# EAGLE design Clock Schematic v.1 (EAGLE 9.3.0)
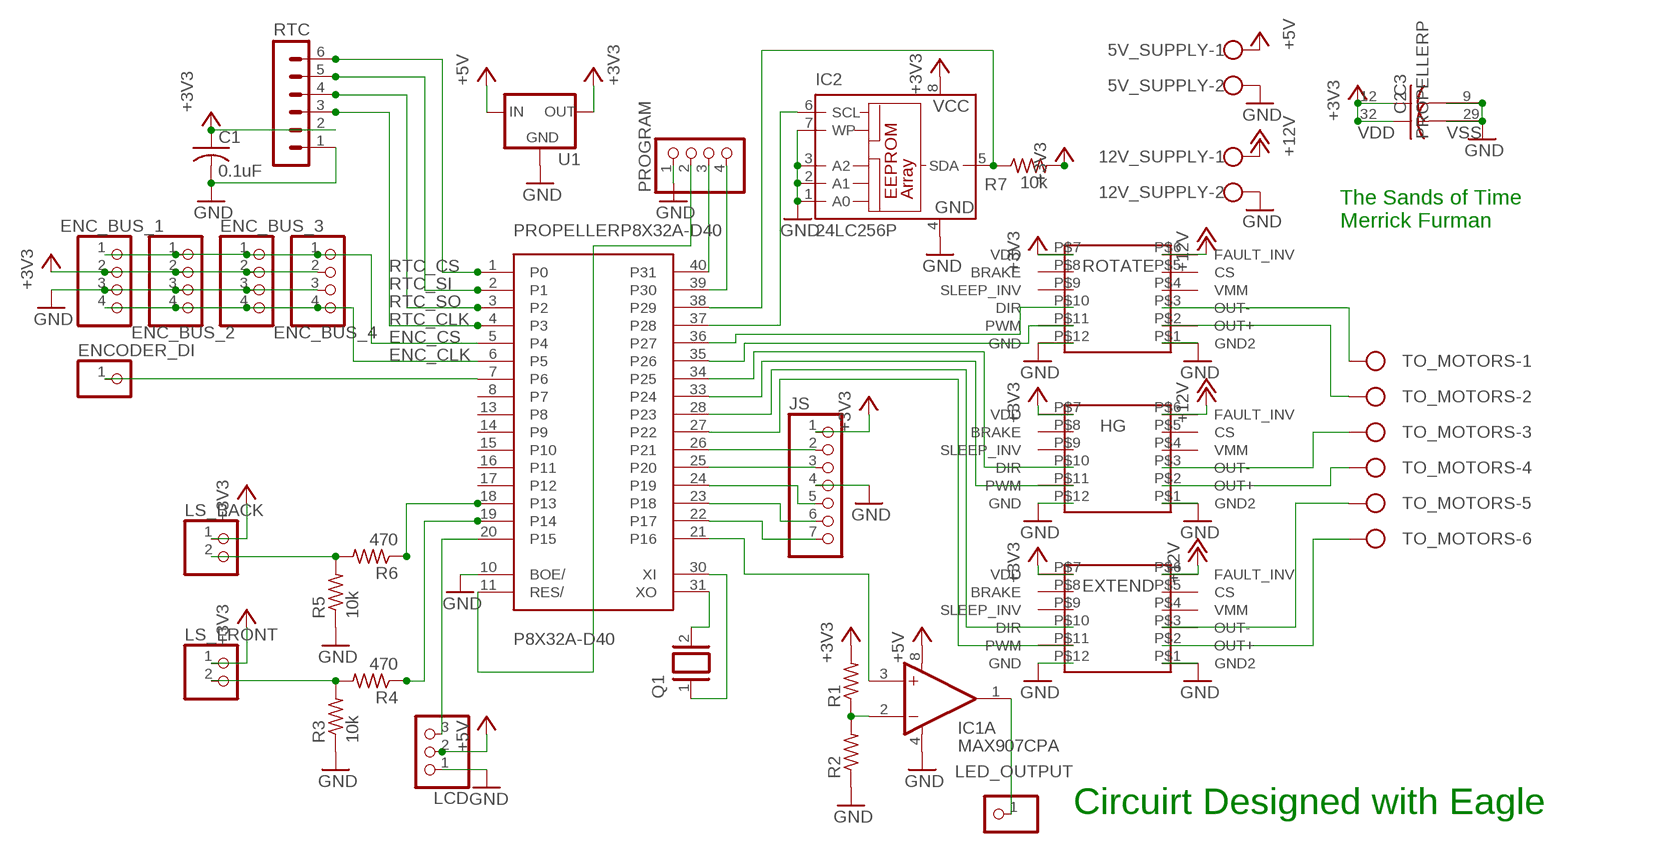
[diagram p0: schematic, sheet 1]

## Parts
5V_SUPPLY  W237-102  [W237-102]
12V_SUPPLY  W237-102  [W237-102]
C1  0.1uF  C-US050-025X075  [C050-025X075]
C2  C-US050-025X075  [C050-025X075]
C3  C-US050-025X075  [C050-025X075]
ENC_BUS_1  PINHD-1X4  [1X04]
ENC_BUS_2  PINHD-1X4  [1X04]
ENC_BUS_3  PINHD-1X4  [1X04]
ENC_BUS_4  PINHD-1X4  [1X04]
ENCODER_DI  PINHD-1X1  [1X01]
EXTEND  DRV  [DRV]
HG  DRV  [DRV]
IC1  MAX907CPA  [DIL08]
IC2  24LC256P  [DIL8]
JS  PINHD-1X7  [1X07]
LCD  PINHD-1X3  [1X03]
LED_OUTPUT  PINHD-1X1  [1X01]
LS_BACK  PINHD-1X2  [1X02]
LS_FRONT  PINHD-1X2  [1X02]
PROGRAM  PINHD-1X4  [1X04]
PROPELLER  P8X32A-D40  [P8X32A-D40]
Q1  XTAL/S  [QS]
R1  R-US_0207/10  [0207/10]
R2  R-US_0207/10  [0207/10]
R3  10k  R-US_0207/10  [0207/10]
R4  470  R-US_0207/10  [0207/10]
R5  10k  R-US_0207/10  [0207/10]
R6  470  R-US_0207/10  [0207/10]
R7  10k  R-US_0207/10  [0207/10]
ROTATE  DRV  [DRV]
RTC  MA06-1  [MA06-1]
TO_MOTORS  W237-6  [W237-6]
U1  V_REG_78XXSIDE  [78XXL]

## Nets
+3V3: C1.1 C2.1 C3.1 ENC_BUS_1.2 ENC_BUS_2.2 ENC_BUS_3.2 ENC_BUS_4.2 EXTEND.P$7(VDD) HG.P$7(VDD) IC2.8(VCC) JS.1 LS_BACK.1 LS_FRONT.1 PROPELLER.12(P:VDD) PROPELLER.32(P:VDD) R1.2 R7.2 ROTATE.P$7(VDD) RTC.2 U1.OUT
+5V: 5V_SUPPLY.1 IC1.8(A:V+) LCD.2 U1.IN
+12V: 12V_SUPPLY.1 EXTEND.P$6(FAULT_INV) HG.P$6(FAULT_INV) ROTATE.P$6(FAULT_INV)
ENC_CLK: ENC_BUS_1.4 ENC_BUS_2.4 ENC_BUS_3.4 ENC_BUS_4.4 PROPELLER.6(P8X32A-D40:P5)
ENC_CS: ENC_BUS_1.1 ENC_BUS_2.1 ENC_BUS_3.1 ENC_BUS_4.1 PROPELLER.5(P8X32A-D40:P4)
GND: 5V_SUPPLY.2 12V_SUPPLY.2 C1.2 C2.2 C3.2 ENC_BUS_1.3 ENC_BUS_2.3 ENC_BUS_3.3 ENC_BUS_4.3 EXTEND.P$1(GND2) EXTEND.P$12(GND) HG.P$1(GND2) HG.P$12(GND) IC1.4(A:V-) IC2.1(A0) IC2.2(A1) IC2.3(A2) IC2.4(GND) IC2.7(WP) JS.4 LCD.1 PROGRAM.1 PROPELLER.9(P:VSS) PROPELLER.10(P8X32A-D40:BOE/) PROPELLER.29(P:VSS) R2.1 R3.1 R5.1 ROTATE.P$1(GND2) ROTATE.P$12(GND) RTC.1 U1.GND
N$1: ENCODER_DI.1 PROPELLER.7(P8X32A-D40:P6)
N$2: JS.5 PROPELLER.24(P8X32A-D40:P19)
N$3: JS.6 PROPELLER.23(P8X32A-D40:P18)
N$4: JS.7 PROPELLER.22(P8X32A-D40:P17)
N$5: JS.3 PROPELLER.25(P8X32A-D40:P20)
N$6: JS.2 PROPELLER.26(P8X32A-D40:P21)
N$7: LCD.3 PROPELLER.20(P8X32A-D40:P15)
N$8: IC1.3(A:+IN) PROPELLER.21(P8X32A-D40:P16)
N$9: IC1.1(A:OUT) LED_OUTPUT.1
N$10: PROPELLER.31(P8X32A-D40:XO) Q1.2
N$11: IC1.2(A:-IN) R1.1 R2.2
N$12: PROPELLER.30(P8X32A-D40:XI) Q1.1
N$13: PROPELLER.19(P8X32A-D40:P14) R4.1
N$14: LS_BACK.2 R5.2 R6.2
N$15: PROPELLER.18(P8X32A-D40:P13) R6.1
N$16: IC2.6(SCL) PROPELLER.37(P8X32A-D40:P28)
N$17: EXTEND.P$11(PWM) PROPELLER.27(P8X32A-D40:P22)
N$18: PROGRAM.4 PROPELLER.39(P8X32A-D40:P30)
N$19: PROGRAM.3 PROPELLER.40(P8X32A-D40:P31)
N$20: IC2.5(SDA) PROPELLER.38(P8X32A-D40:P29) R7.1
N$22: EXTEND.P$10(DIR) PROPELLER.28(P8X32A-D40:P23)
N$23: HG.P$11(PWM) PROPELLER.33(P8X32A-D40:P24)
N$24: HG.P$10(DIR) PROPELLER.34(P8X32A-D40:P25)
N$25: PROPELLER.35(P8X32A-D40:P26) ROTATE.P$11(PWM)
N$26: PROGRAM.2 PROPELLER.11(P8X32A-D40:RES/)
N$27: LS_FRONT.2 R3.2 R4.2
N$28: PROPELLER.36(P8X32A-D40:P27) ROTATE.P$10(DIR)
N$29: ROTATE.P$3(OUT-) TO_MOTORS.1
N$30: ROTATE.P$2(OUT+) TO_MOTORS.2
N$31: HG.P$3(OUT-) TO_MOTORS.3
N$32: HG.P$2(OUT+) TO_MOTORS.4
N$33: EXTEND.P$3(OUT-) TO_MOTORS.5
N$34: EXTEND.P$2(OUT+) TO_MOTORS.6
RTC_CLK: PROPELLER.4(P8X32A-D40:P3) RTC.3
RTC_CS: PROPELLER.1(P8X32A-D40:P0) RTC.6
RTC_SI: PROPELLER.2(P8X32A-D40:P1) RTC.5
RTC_SO: PROPELLER.3(P8X32A-D40:P2) RTC.4
Unconnected: EXTEND.P$4(VMM) EXTEND.P$5(CS) EXTEND.P$8(BRAKE) EXTEND.P$9(SLEEP_INV) HG.P$4(VMM) HG.P$5(CS) HG.P$8(BRAKE) HG.P$9(SLEEP_INV) IC1.5(B:+IN) IC1.6(B:-IN) IC1.7(B:OUT) PROPELLER.8(P8X32A-D40:P7) PROPELLER.13(P8X32A-D40:P8) PROPELLER.14(P8X32A-D40:P9) PROPELLER.15(P8X32A-D40:P10) PROPELLER.16(P8X32A-D40:P11) PROPELLER.17(P8X32A-D40:P12) ROTATE.P$4(VMM) ROTATE.P$5(CS) ROTATE.P$8(BRAKE) ROTATE.P$9(SLEEP_INV)

## Notes on the sheet
- The Sands of Time
  Merrick Furman
- Circuirt Designed with Eagle

## Library data of the parts
5V_SUPPLY 12V_SUPPLY = con-wago-500:W237-102: WAGO SCREW CLAMP; MPN: 237-102; OC_FARNELL: unknown; OC_NEWARK: 70K9898
C1-C3 = rcl:C-US: CAPACITOR, American symbol; SPICEPREFIX: C
ENC_BUS_1-ENC_BUS_4 PROGRAM = pinhead:PINHD-1X4: PIN HEADER
ENCODER_DI LED_OUTPUT = pinhead:PINHD-1X1: PIN HEADER
EXTEND HG ROTATE = Pololu_DRV8801_Breakout:DRV
IC1 = maxim:MAX907CPA: COMPARATOR; MF: MAXIM; MPN: MAX907CPA; OC_FARNELL: unknown; OC_NEWARK: 79C3004
IC2 = microchip:24*: Serial EEPROM I2C; MF: MICROCHIP; MPN: 24LC256-E/P; OC_FARNELL: 9757970; OC_NEWARK: 92C7169
JS = pinhead:PINHD-1X7: PIN HEADER
LCD = pinhead:PINHD-1X3: PIN HEADER
LS_BACK LS_FRONT = pinhead:PINHD-1X2: PIN HEADER
PROPELLER = parallax_propeller:P8X32A-D40
Q1 = special:XTAL/S: CRYSTAL
R1-R7 = rcl:R-US_: RESISTOR, American symbol; SPICEPREFIX: R
RTC = con-lstb:MA06-1: PIN HEADER; OC_FARNELL: unknown; OC_NEWARK: unknown
TO_MOTORS = con-wago-500:W237-6: WAGO SCREW CLAMP; OC_FARNELL: unknown; OC_NEWARK: unknown
U1 = SparkFun-IC-Power:V_REG_78XX: Voltage Regulator Standard 78xx regulator. IGO (Input Ground Output). Spark Fun Electronics SKU : COM-00107

## Board
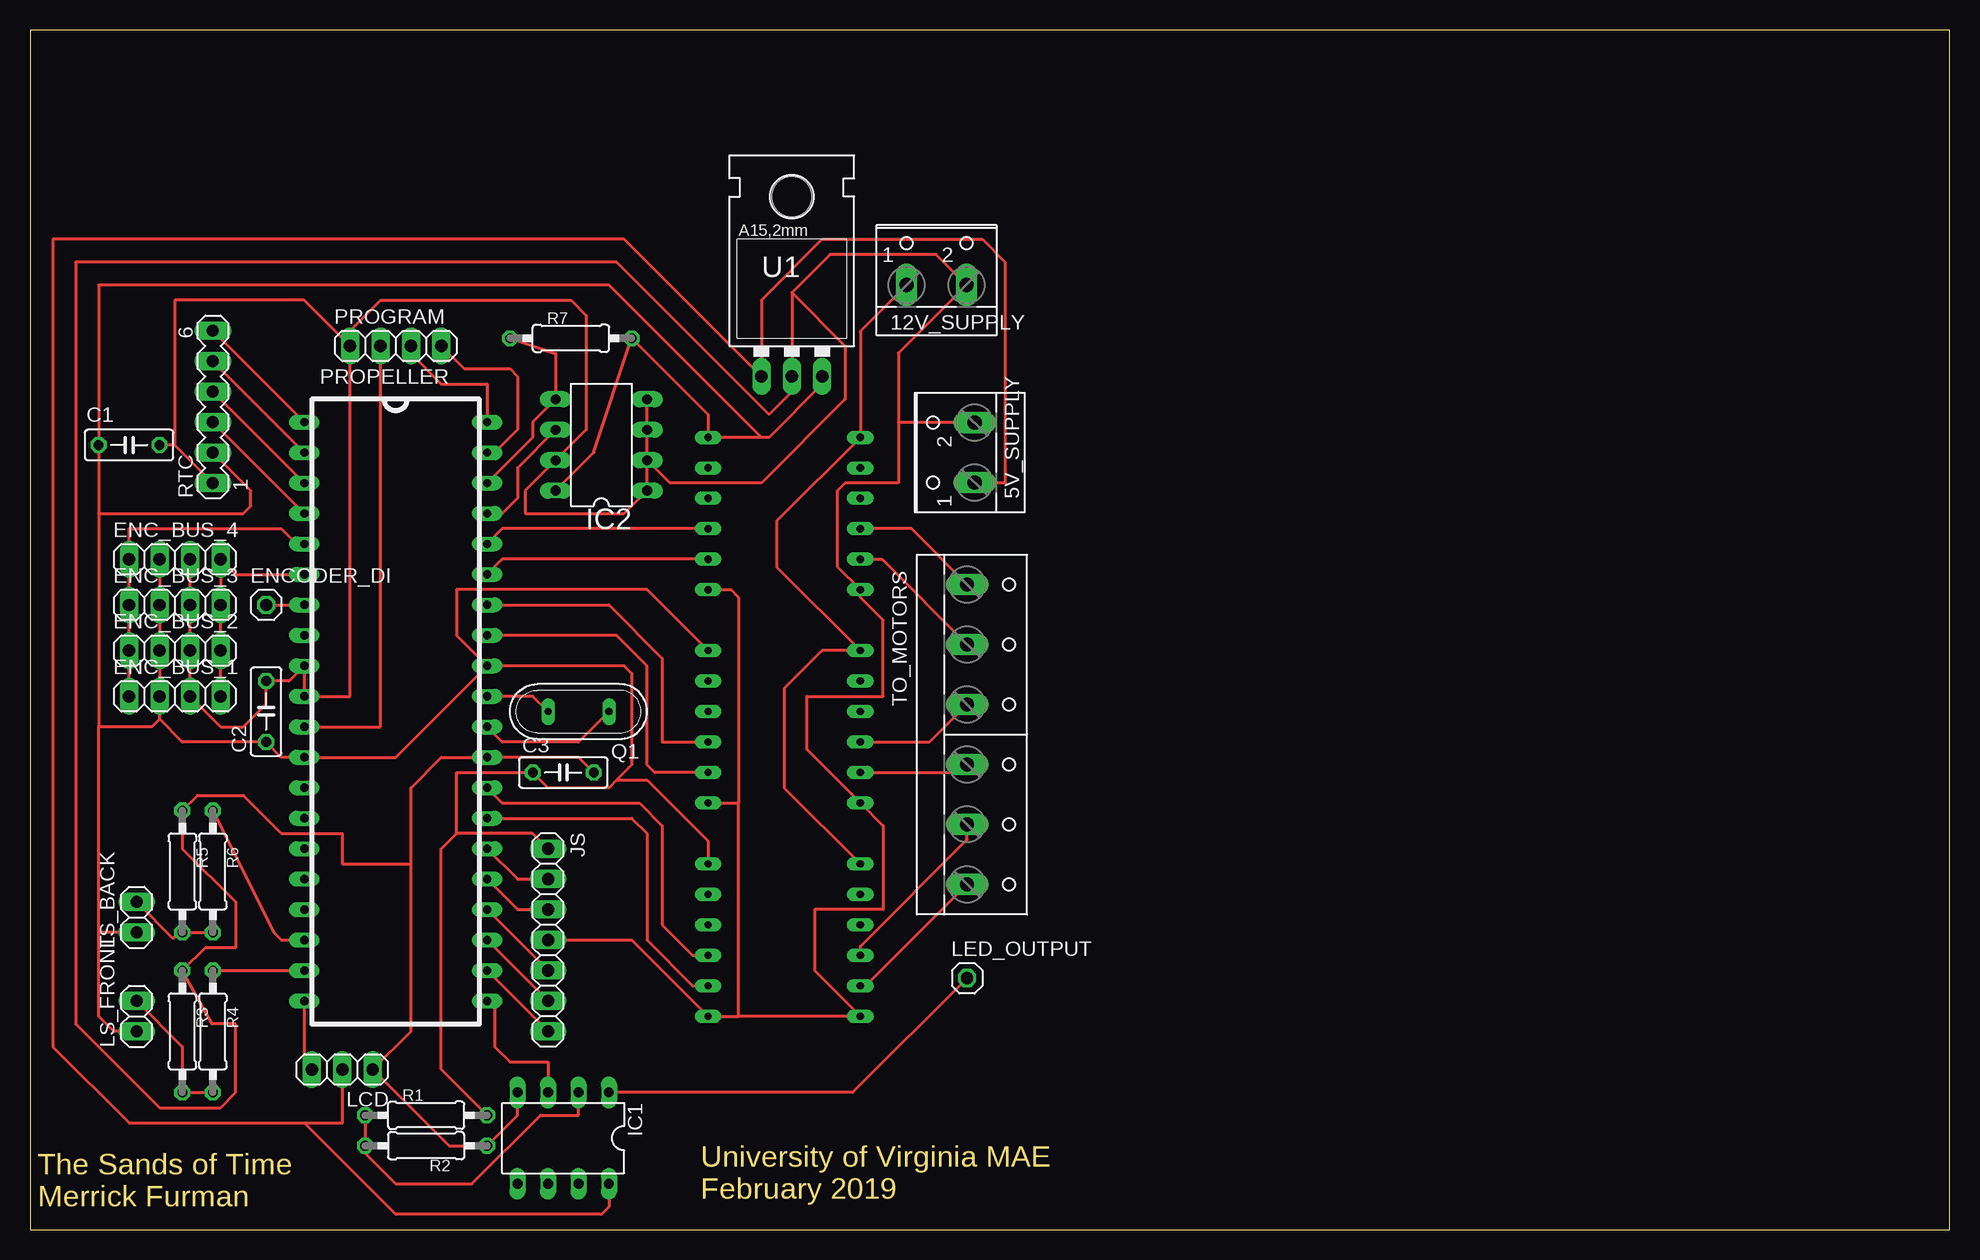
[diagram p1: board, top side]
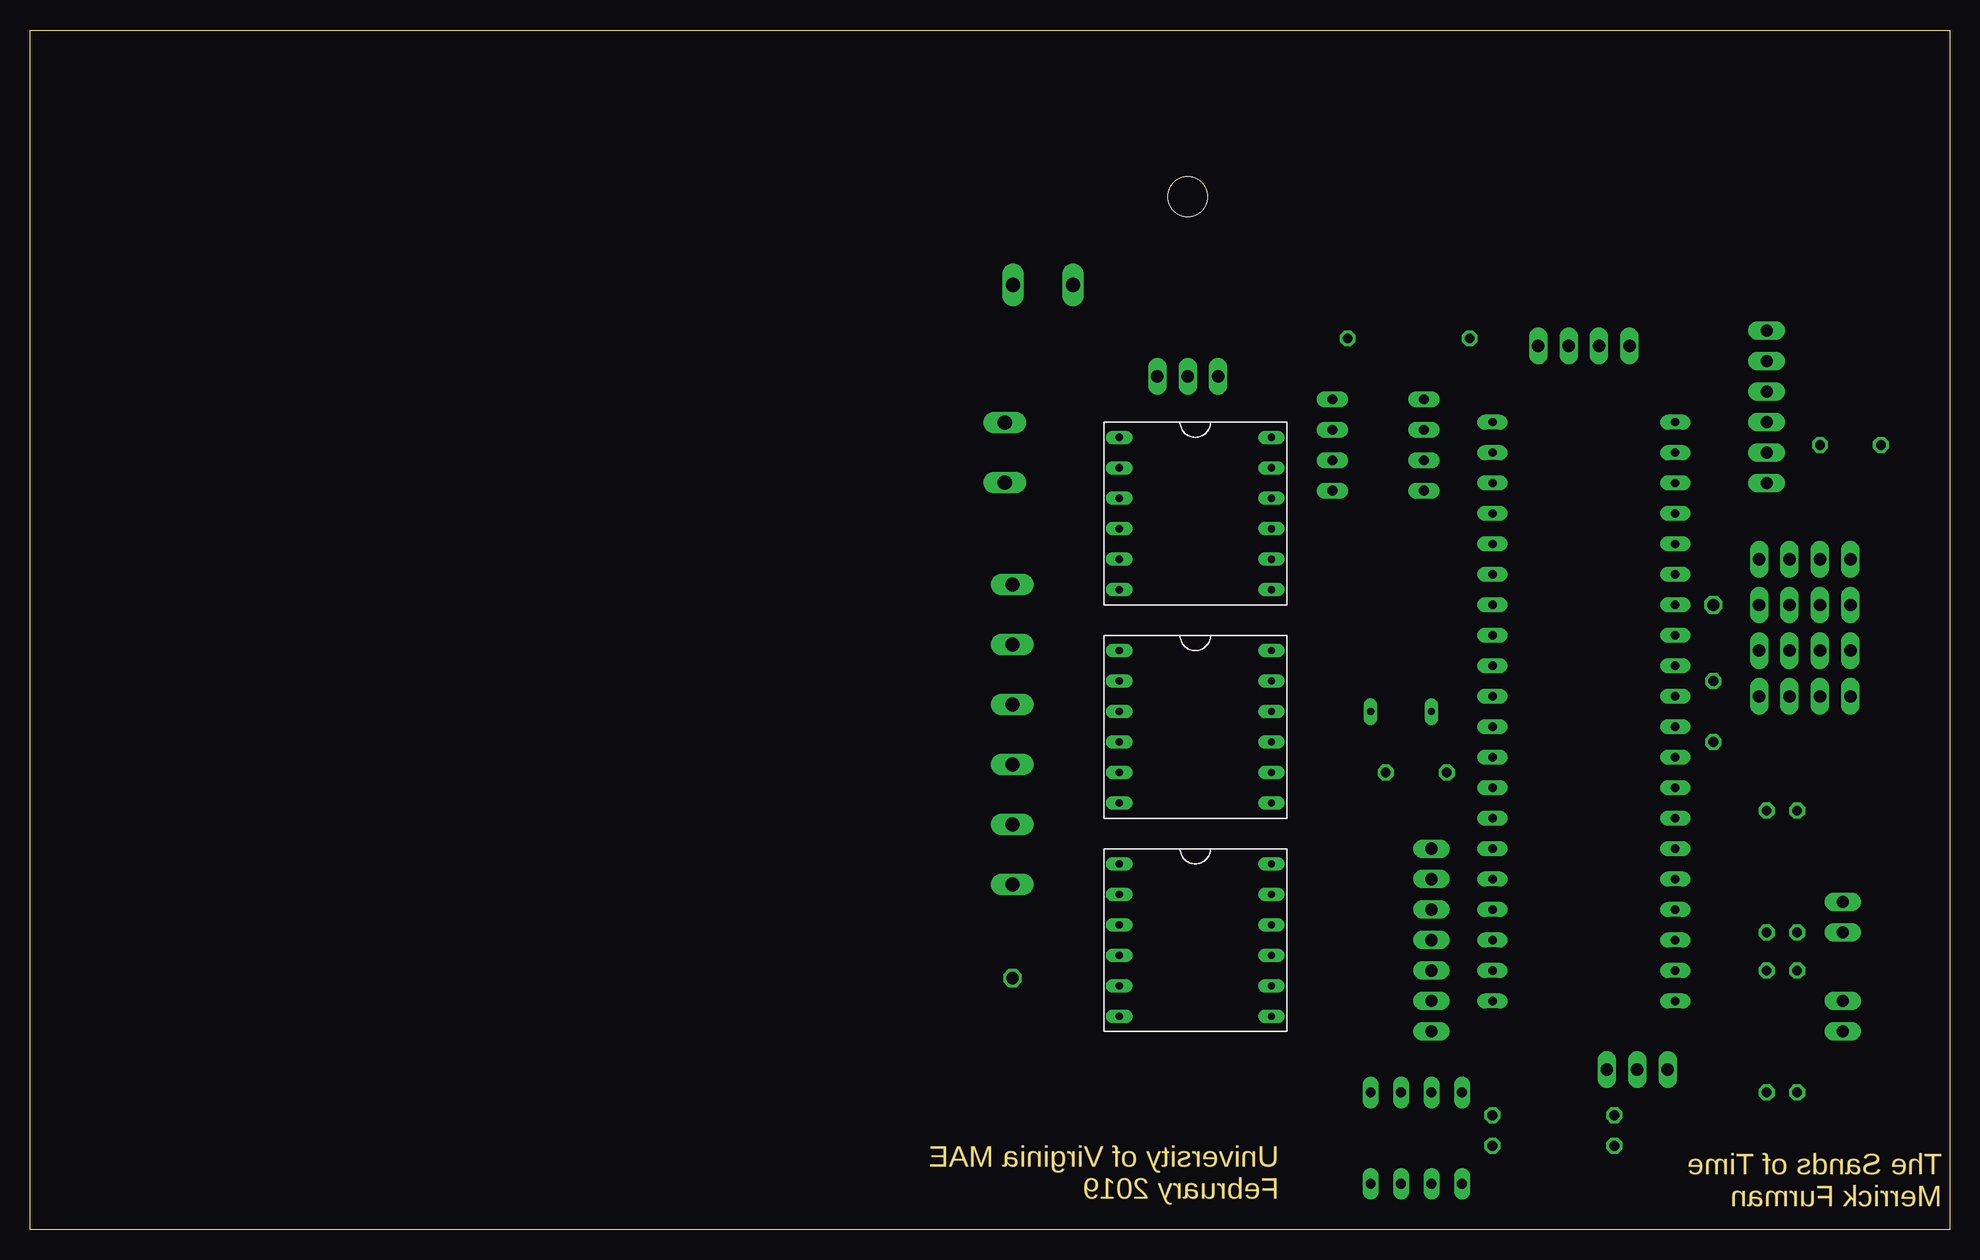
[diagram p2: board, bottom side, seen from below]

Size 160 x 100 mm. Coordinates in mm from the lower left corner, seen from the top.
Outline: 0,0 160,0 160,100 0,100 0,0
Copper layers (1*16): Top 0.035mm / dielectric 1.5mm / Bottom 0.035mm
Design rules "default": minimum track width 6mil, minimum drill 0.35mm, track to track 6mil, track to pad 6mil, pad to pad 6mil, via to via 6mil, smd to smd 6mil, copper to edge 40mil, drill to drill 6mil, minimum pad ring 10mil, minimum via ring 8mil, stop-mask expansion 4mil, vias tented up to drill 0mil, thermal gap 10mil

### Footprints (pad centres in the part's own frame; a part is rotated, then mirrored left to right if it is on the bottom)
W237-102 = drill 1.194 long: 1 -2.5,-1.27; 2 2.5,-1.27
C050-025X075 = drill 0.813 octagon: 1 -2.54,0; 2 2.54,0
1X04 = drill 1.016 long: 1 -3.81,0; 2 -1.27,0; 3 1.27,0; 4 3.81,0
1X01 = drill 1.016 octagon: 1 0,0
DRV = drill 0.6 long: P$1 1.27,1.27; P$2 1.27,3.81; P$3 1.27,6.35; P$4 1.27,8.89; P$5 1.27,11.43; P$6 1.27,13.97; P$7 13.97,13.97; P$8 13.97,11.43; P$9 13.97,8.89; P$10 13.97,6.35; P$11 13.97,3.81; P$12 13.97,1.27
DIL08 = drill 0.813 long: 1 -3.81,-3.81; 2 -1.27,-3.81; 3 1.27,-3.81; 4 3.81,-3.81; 5 3.81,3.81; 6 1.27,3.81; 7 -1.27,3.81; 8 -3.81,3.81
DIL8 = drill 0.813 long: 1 -3.81,-3.81; 2 -1.27,-3.81; 3 1.27,-3.81; 4 3.81,-3.81; 5 3.81,3.81; 6 1.27,3.81; 7 -1.27,3.81; 8 -3.81,3.81
1X07 = drill 1.016 long: 1 -7.62,0; 2 -5.08,0; 3 -2.54,0; 4 0,0; 5 2.54,0; 6 5.08,0; 7 7.62,0
1X03 = drill 1.016 long: 1 -2.54,0; 2 0,0; 3 2.54,0
1X02 = drill 1.016 long: 1 -1.27,0; 2 1.27,0
P8X32A-D40 = drill 0.7 pad 1.27 long: 1 -7.62,23.495; 2 -7.62,20.955; 3 -7.62,18.415; 4 -7.62,15.875; 5 -7.62,13.335; 6 -7.62,10.795; 7 -7.62,8.255; 8 -7.62,5.715; 9 -7.62,3.175; 10 -7.62,0.635; 11 -7.62,-1.905; 12 -7.62,-4.445; 13 -7.62,-6.985; 14 -7.62,-9.525; 15 -7.62,-12.065; 16 -7.62,-14.605; 17 -7.62,-17.145; 18 -7.62,-19.685; 19 -7.62,-22.225; 20 -7.62,-24.765; 21 7.62,-24.765; 22 7.62,-22.225; 23 7.62,-19.685; 24 7.62,-17.145; 25 7.62,-14.605; 26 7.62,-12.065; 27 7.62,-9.525; 28 7.62,-6.985; 29 7.62,-4.445; 30 7.62,-1.905; 31 7.62,0.635; 32 7.62,3.175; 33 7.62,5.715; 34 7.62,8.255; 35 7.62,10.795; 36 7.62,13.335; 37 7.62,15.875; 38 7.62,18.415; 39 7.62,20.955; 40 7.62,23.495
QS = drill 0.61 long: 1 -2.54,0; 2 2.54,0
0207/10 = drill 0.813 octagon: 1 -5.08,0; 2 5.08,0
MA06-1 = drill 1.016 long: 1 -6.35,0; 2 -3.81,0; 3 -1.27,0; 4 1.27,0; 5 3.81,0; 6 6.35,0
W237-6 = drill 1.194 long: 1 -12.5,-1.27; 2 -7.5,-1.27; 3 -2.5,-1.27; 4 2.5,-1.27; 5 7.5,-1.27; 6 12.5,-1.27
78XXL = drill 1.016 long: GND 0,-3.81; IN -2.54,-3.81; OUT 2.54,-3.81 | hole 3.302: 0,11.176

### Placement (x,y rotation side)
5V_SUPPLY  77.47,64.77 90 top
12V_SUPPLY  75.56,80.01 0 top
C1  8.26,65.41 0 top
C2  19.68,43.18 90 top
C3  44.45,38.1 0 top
ENC_BUS_1  12.06,44.45 0 top
ENC_BUS_2  12.06,48.26 0 top
ENC_BUS_3  12.06,52.07 0 top
ENC_BUS_4  12.06,55.88 0 top
ENCODER_DI  19.68,52.07 0 top
EXTEND  70.48,16.51 0 bottom
HG  70.48,34.29 0 bottom
IC1  44.45,7.62 180 top
IC2  47.62,65.41 90 top
JS  43.18,24.13 270 top
LCD  26.04,13.34 180 top
LED_OUTPUT  78.11,20.95 0 top
LS_BACK  8.89,26.04 90 top
LS_FRONT  8.89,17.78 90 top
PROGRAM  30.48,73.66 0 top
PROPELLER  30.48,43.81 0 top
Q1  45.72,43.18 180 top
R1  33.02,9.53 0 top
R2  33.02,6.99 180 top
R3  12.7,16.51 270 top
R4  15.24,16.51 270 top
R5  12.7,29.84 270 top
R6  15.24,29.84 270 top
R7  45.09,74.3 0 top
ROTATE  70.48,52.07 0 bottom
RTC  15.24,68.58 90 top
TO_MOTORS  79.38,41.27 270 top
U1  63.5,74.93 0 top

### Tracks (layer width: path | path; a pad name or v marks a point on that pad's centre or on a via)
+3V3
  Top 0.254: PROPELLER.32 49.53,46.99 50.16,46.35 50.16,38.73 48.9,37.47 | 48.9,37.47 48.26,36.83 43.18,36.83 C3.1 35.56,38.1 35.56,33.02 | PROPELLER.32 30.48,39.37 PROPELLER.12 20.95,39.37 C2.1 12.7,40.64 10.79,42.55 | 10.79,42.55 ENC_BUS_1.2 ENC_BUS_2.2 ENC_BUS_3.2 ENC_BUS_4.2 | 10.79,42.55 10.16,41.91 5.71,41.91 | U1.OUT 66.04,70.48 61.59,66.04 60.96,66.04 | 60.96,66.04 ROTATE.P$7 56.52,67.94 R7.2 46.99,64.77 IC2.8 | 48.9,37.47 51.44,37.47 56.52,32.38 EXTEND.P$7 | 5.71,59.69 C1.1 5.71,78.74 48.26,78.74 60.96,66.04 | 5.71,59.69 5.71,41.91 | 5.71,59.69 17.78,59.69 18.41,60.33 18.41,61.59 RTC.2 | JS.1 41.91,33.02 35.56,33.02 | HG.P$7 51.44,53.34 35.56,53.34 35.56,49.53 PROPELLER.32 | R1.2 34.29,13.34 34.29,31.75 35.56,33.02 | LS_FRONT.1 6.99,16.51 5.71,17.78 5.71,24.77 | 5.71,24.77 5.71,41.91 | LS_BACK.1 5.71,24.77
+5V
  Top 0.254: LCD.2 26.04,8.89 22.86,8.89 | 22.86,8.89 30.48,1.27 47.62,1.27 48.26,1.91 IC1.8 | 22.86,8.89 8.26,8.89 1.91,15.24 1.91,82.55 49.53,82.55 U1.IN 60.96,77.47 66.04,82.55 79.38,82.55 81.28,80.64 81.28,62.23 78.78,62.23 5V_SUPPLY.1
+12V
  Top 0.254: EXTEND.P$6 62.87,36.83 62.87,45.09 66.04,48.26 HG.P$6 62.23,55.24 62.23,59.05 ROTATE.P$6 69.22,74.89 12V_SUPPLY.1
ENC_CLK
  Top 0.254: PROPELLER.6 17.14,54.61 ENC_BUS_4.4 ENC_BUS_3.4 ENC_BUS_2.4 ENC_BUS_1.4
ENC_CS
  Top 0.254: ENC_BUS_1.1 ENC_BUS_2.1 ENC_BUS_3.1 ENC_BUS_4.1 8.26,58.42 20.95,58.42 22.23,57.15 PROPELLER.5
GND
  Top 0.254: HG.P$12 59.05,35.56 | 59.05,17.78 EXTEND.P$12 50.16,24.13 JS.4 | C3.2 45.72,39.37 PROPELLER.29 34.29,39.37 31.75,36.83 31.75,30.48 | ROTATE.P$12 58.42,53.34 59.05,52.7 59.05,35.56 | 59.05,17.78 59.05,35.56 | 59.05,17.78 EXTEND.P$1 65.41,21.59 65.41,26.67 71.12,26.67 71.12,33.66 HG.P$1 64.77,40.01 64.77,44.45 71.12,44.45 71.12,50.8 69.22,52.7 ROTATE.P$1 67.31,55.24 67.31,61.59 67.94,62.23 72.39,62.23 72.39,67.31 | ENC_BUS_4.3 ENC_BUS_3.3 ENC_BUS_2.3 ENC_BUS_1.3 15.88,41.91 17.78,41.91 19.68,43.81 C2.2 21.59,45.72 PROPELLER.9 PROPELLER.10 26.67,44.45 PROGRAM.1 | IC2.2 IC2.1 49.53,59.69 41.27,59.69 41.27,61.59 IC2.7 46.35,66.67 46.35,76.2 45.09,77.47 29.21,77.47 26.67,74.93 PROGRAM.1 | IC2.2 IC2.3 IC2.4 | 63.5,78.11 66.67,81.28 75.53,81.28 12V_SUPPLY.2 72.39,73.06 72.39,67.31 | 63.5,78.11 U1.GND 63.5,69.85 61.59,67.94 48.9,80.64 3.81,80.64 3.81,17.14 10.79,10.16 15.88,10.16 17.14,11.43 17.14,17.14 15.17,17.14 R3.1 14.61,23.5 17.14,23.5 17.14,27.3 12.7,31.75 R5.1 13.97,36.2 17.78,36.2 20.95,33.02 26.04,33.02 26.04,30.48 31.75,30.48 | 63.5,78.11 67.94,73.66 67.94,69.22 60.96,62.23 53.34,62.23 IC2.2 | 31.75,30.48 31.75,16.51 LCD.1 34.92,6.99 R2.1 40.64,9.53 IC1.4 | RTC.1 12.06,65.41 | 12.06,65.41 C1.2 | PROGRAM.1 22.86,77.47 12.06,77.47 12.06,65.41 | 5V_SUPPLY.2 72.43,67.27 72.39,67.31
N$1
  Top 0.254: ENCODER_DI.1 PROPELLER.7
N$2
  Top 0.254: PROPELLER.24 JS.5
N$3
  Top 0.254: PROPELLER.23 JS.6
N$4
  Top 0.254: PROPELLER.22 JS.7
N$5
  Top 0.254: PROPELLER.25 40.64,26.67 JS.3
N$6
  Top 0.254: PROPELLER.26 40.64,29.21 JS.2
N$7
  Top 0.254: PROPELLER.20 22.86,13.97 LCD.3
N$8
  Top 0.254: PROPELLER.21 38.73,18.41 38.73,15.24 40.01,13.97 43.18,13.97 IC1.3
N$9
  Top 0.254: LED_OUTPUT.1 68.58,11.43 IC1.1
N$10
  Top 0.254: Q1.2 41.91,44.45 PROPELLER.31
N$11
  Top 0.254: R1.1 R2.2 27.94,6.35 30.48,3.81 36.83,3.81 42.55,9.53 45.72,9.53 IC1.2
N$12
  Top 0.254: Q1.1 45.72,40.64 39.37,40.64 PROPELLER.30
N$13
  Top 0.254: R4.1 PROPELLER.19
N$14
  Top 0.254: R6.2 R5.2 11.91,24.29 LS_BACK.2
N$15
  Top 0.254: R6.1 20.32,24.77 20.95,24.13 PROPELLER.18
N$16
  Top 0.254: PROPELLER.37 39.37,59.69 40.64,60.96 40.64,63.5 IC2.6
N$17
  Top 0.254: EXTEND.P$11 55.24,20.32 51.44,24.13 51.44,33.02 50.16,34.29 PROPELLER.27
N$18
  Top 0.254: PROGRAM.4 36.2,71.75 40.01,71.75 40.64,71.12 40.64,66.67 38.73,64.77 PROPELLER.39
N$19
  Top 0.254: PROGRAM.3 31.75,73.03 34.29,70.48 38.1,70.48 PROPELLER.40
N$20
  Top 0.254: R7.1 43.81,73.03 IC2.5 41.91,67.31 41.91,66.04 PROPELLER.38
N$22
  Top 0.254: PROPELLER.28 39.37,35.56 50.8,35.56 52.7,33.66 52.7,25.4 55.24,22.86 EXTEND.P$10
N$23
  Top 0.254: HG.P$11 52.07,38.1 51.44,38.73 51.44,46.99 48.9,49.53 PROPELLER.33
N$24
  Top 0.254: PROPELLER.34 48.26,52.07 52.7,47.62 52.7,40.64 HG.P$10
N$25
  Top 0.254: ROTATE.P$11 39.37,55.88 PROPELLER.35
N$26
  Top 0.254: PROPELLER.11 29.21,41.91 PROGRAM.2
N$27
  Top 0.254: R4.2 R3.2 12.7,15.24 LS_FRONT.2
N$28
  Top 0.254: ROTATE.P$10 39.37,58.42 PROPELLER.36
N$29
  Top 0.254: TO_MOTORS.1 73.46,58.42 ROTATE.P$3
N$30
  Top 0.254: TO_MOTORS.2 71,55.88 ROTATE.P$2
N$31
  Top 0.254: HG.P$3 74.97,40.64 TO_MOTORS.3
N$32
  Top 0.254: HG.P$2 77.43,38.1 TO_MOTORS.4
N$33
  Top 0.254: EXTEND.P$3 69.22,23.61 78.11,32.51 TO_MOTORS.5
N$34
  Top 0.254: EXTEND.P$2 69.65,20.32 TO_MOTORS.6
RTC_CLK
  Top 0.254: RTC.3 PROPELLER.4
RTC_CS
  Top 0.254: RTC.6 PROPELLER.1
RTC_SI
  Top 0.254: RTC.5 PROPELLER.2
RTC_SO
  Top 0.254: RTC.4 PROPELLER.3

### Text on the board
Dimension: University of Virginia MAE / February 2019 | The Sands of Time / Merrick Furman